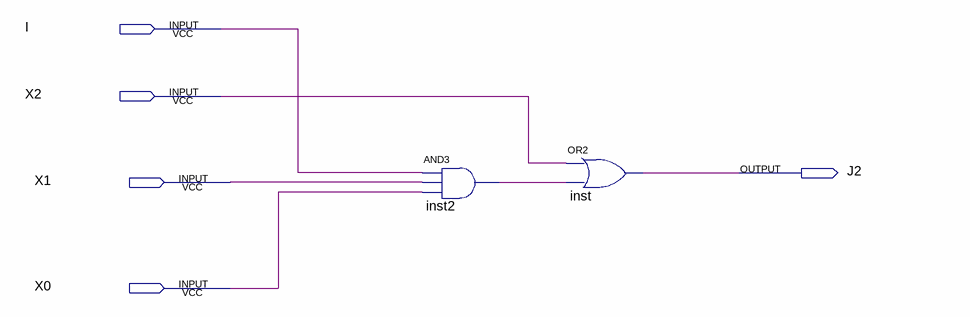
[diagram p0: schematic sheet]
// Quartus schematic J2.bdf as structural Verilog: 2 symbols, 5 pins
module J2 (
  input  I,
  input  X2,
  input  X1,
  input  X0,
  output J2
);

  wire inst2_out;

  and inst2 (inst2_out, I, X1, X0);
  or inst (J2, X2, inst2_out);
endmodule
